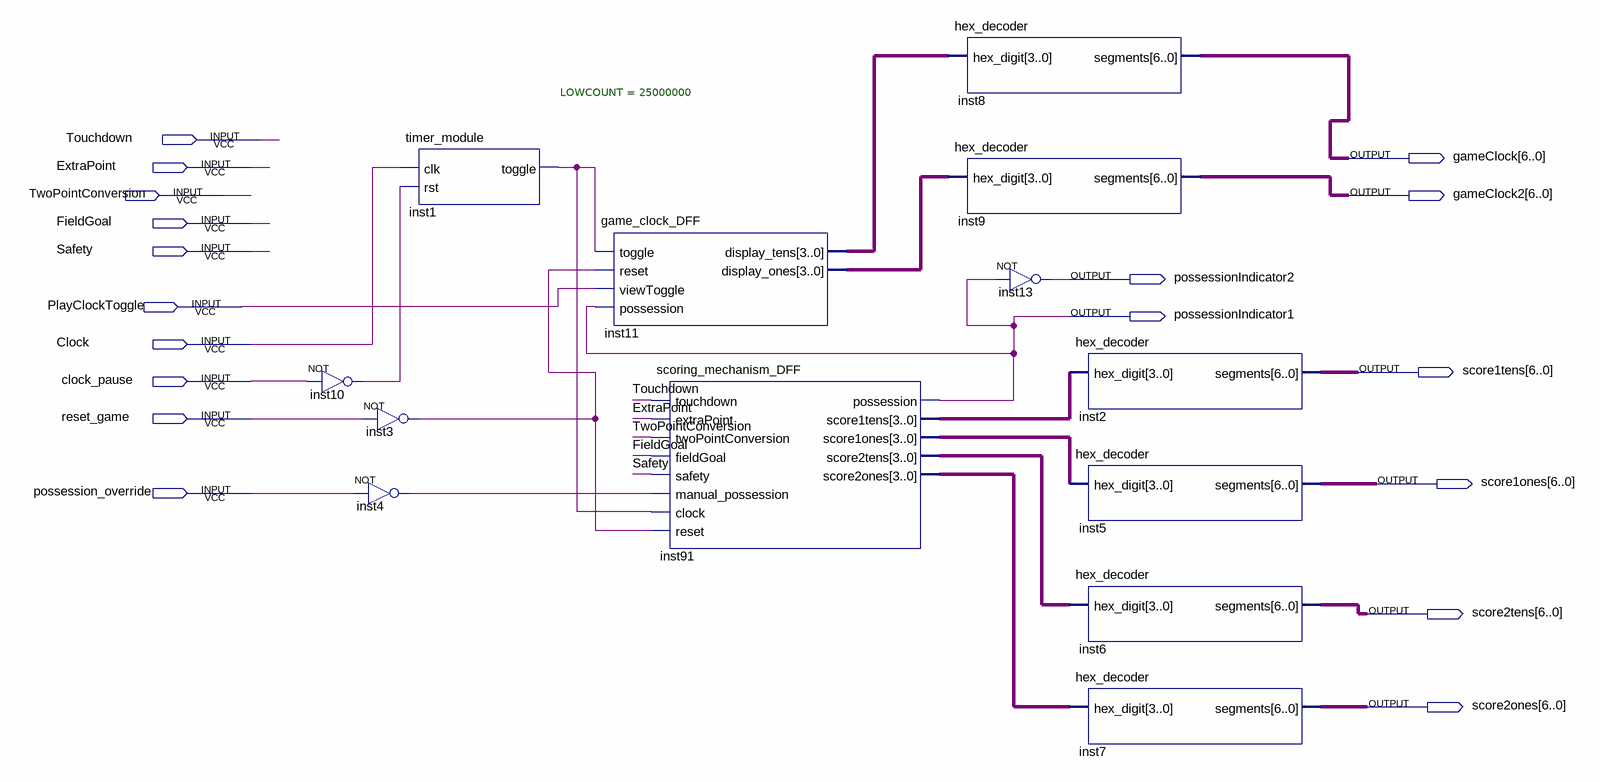
[diagram p0: schematic sheet]
// Quartus schematic FootballScoreboardProject.bdf as structural Verilog: 13 symbols, 18 pins
module FootballScoreboardProject (
  input  Touchdown,
  input  ExtraPoint,
  input  TwoPointConversion,
  input  FieldGoal,
  input  Safety,
  input  PlayClockToggle,
  input  Clock,
  input  clock_pause,
  input  reset_game,
  input  possession_override,
  output [6:0] gameClock,
  output [6:0] gameClock2,
  output possessionIndicator2,
  output possessionIndicator1,
  output [6:0] score1tens,
  output [6:0] score1ones,
  output [6:0] score2tens,
  output [6:0] score2ones
);

  wire inst1_toggle, inst3_out, inst4_out, inst10_out;
  wire [3:0] inst11_display_ones, inst11_display_tens, inst91_score1ones, inst91_score1tens,
       inst91_score2ones, inst91_score2tens;

  not inst10 (inst10_out, clock_pause);
  timer_module #(.LOWCOUNT(25000000)) inst1 (.clk(Clock), .rst(inst10_out), .toggle(inst1_toggle));
  not inst3 (inst3_out, reset_game);
  not inst4 (inst4_out, possession_override);
  game_clock_DFF inst11 (
    .toggle(inst1_toggle), .reset(inst3_out), .viewToggle(PlayClockToggle),
    .possession(possessionIndicator1), .display_tens(inst11_display_tens), .display_ones(inst11_display_ones));
  scoring_mechanism_DFF inst91 (
    .touchdown(Touchdown), .extraPoint(ExtraPoint), .twoPointConversion(TwoPointConversion),
    .fieldGoal(FieldGoal), .safety(Safety), .manual_possession(inst4_out), .clock(inst1_toggle),
    .reset(inst3_out), .possession(possessionIndicator1), .score1tens(inst91_score1tens),
    .score1ones(inst91_score1ones), .score2tens(inst91_score2tens), .score2ones(inst91_score2ones));
  hex_decoder inst8 (.hex_digit(inst11_display_tens), .segments(gameClock));
  hex_decoder inst9 (.hex_digit(inst11_display_ones), .segments(gameClock2));
  not inst13 (possessionIndicator2, possessionIndicator1);
  hex_decoder inst2 (.hex_digit(inst91_score1tens), .segments(score1tens));
  hex_decoder inst5 (.hex_digit(inst91_score1ones), .segments(score1ones));
  hex_decoder inst6 (.hex_digit(inst91_score2tens), .segments(score2tens));
  hex_decoder inst7 (.hex_digit(inst91_score2ones), .segments(score2ones));
endmodule
